# Altium project PCB_Bachelor.PrjPcb
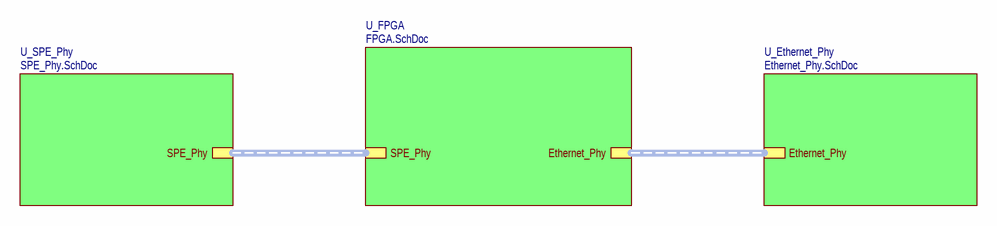
[diagram p0: TopLevel.SchDoc]
Вид_документа_SCH: Схема электрическая принципиальная; Код_документа_SCH: Э3; Обозначение_PCB: SPE_Ethernet; Обозначение_Код: SPE_Ethernet; Формат_PCB: А2
4 sheets, 154 parts. Net scope: hierarchical (ports join the sheet entries above them; power ports are global).
Board file: SPE_To_Ethernet.PcbDoc
Sheets:
  TopLevel.SchDoc
    U_FPGA = FPGA.SchDoc
    U_SPE_Phy = SPE_Phy.SchDoc
    U_Ethernet_Phy = Ethernet_Phy.SchDoc

## Sheet TopLevel.SchDoc
size 420 x 297 mm; SheetNumber: 1; SheetTotal: 4

### Sub-sheets
U_Ethernet_Phy = Ethernet_Phy.SchDoc: Ethernet_Phy (harness Ethernet)
U_FPGA = FPGA.SchDoc: Ethernet_Phy (harness Ethernet), SPE_Phy (harness SPE)
U_SPE_Phy = SPE_Phy.SchDoc: SPE_Phy (harness SPE)

### Buses and harness runs
harness sheet U_Ethernet_Phy/Ethernet_Phy = sheet U_FPGA/Ethernet_Phy
harness sheet U_FPGA/SPE_Phy = sheet U_SPE_Phy/SPE_Phy

### Notes on the sheet
- Подп. дата
- Инв. № дубл.
- Взам. инв. №
- Подп. и дата
- Инв. № подл.
- Изм.
- Лист
- № докум.
- Подп.
- Дата
- ALTIUM GOSTBOM2.0 KEV
- Файл:
- Копировал
- Формат А3

## Sheet FPGA.SchDoc
size 840 x 594 mm; SheetNumber: 2; SheetTotal: 4
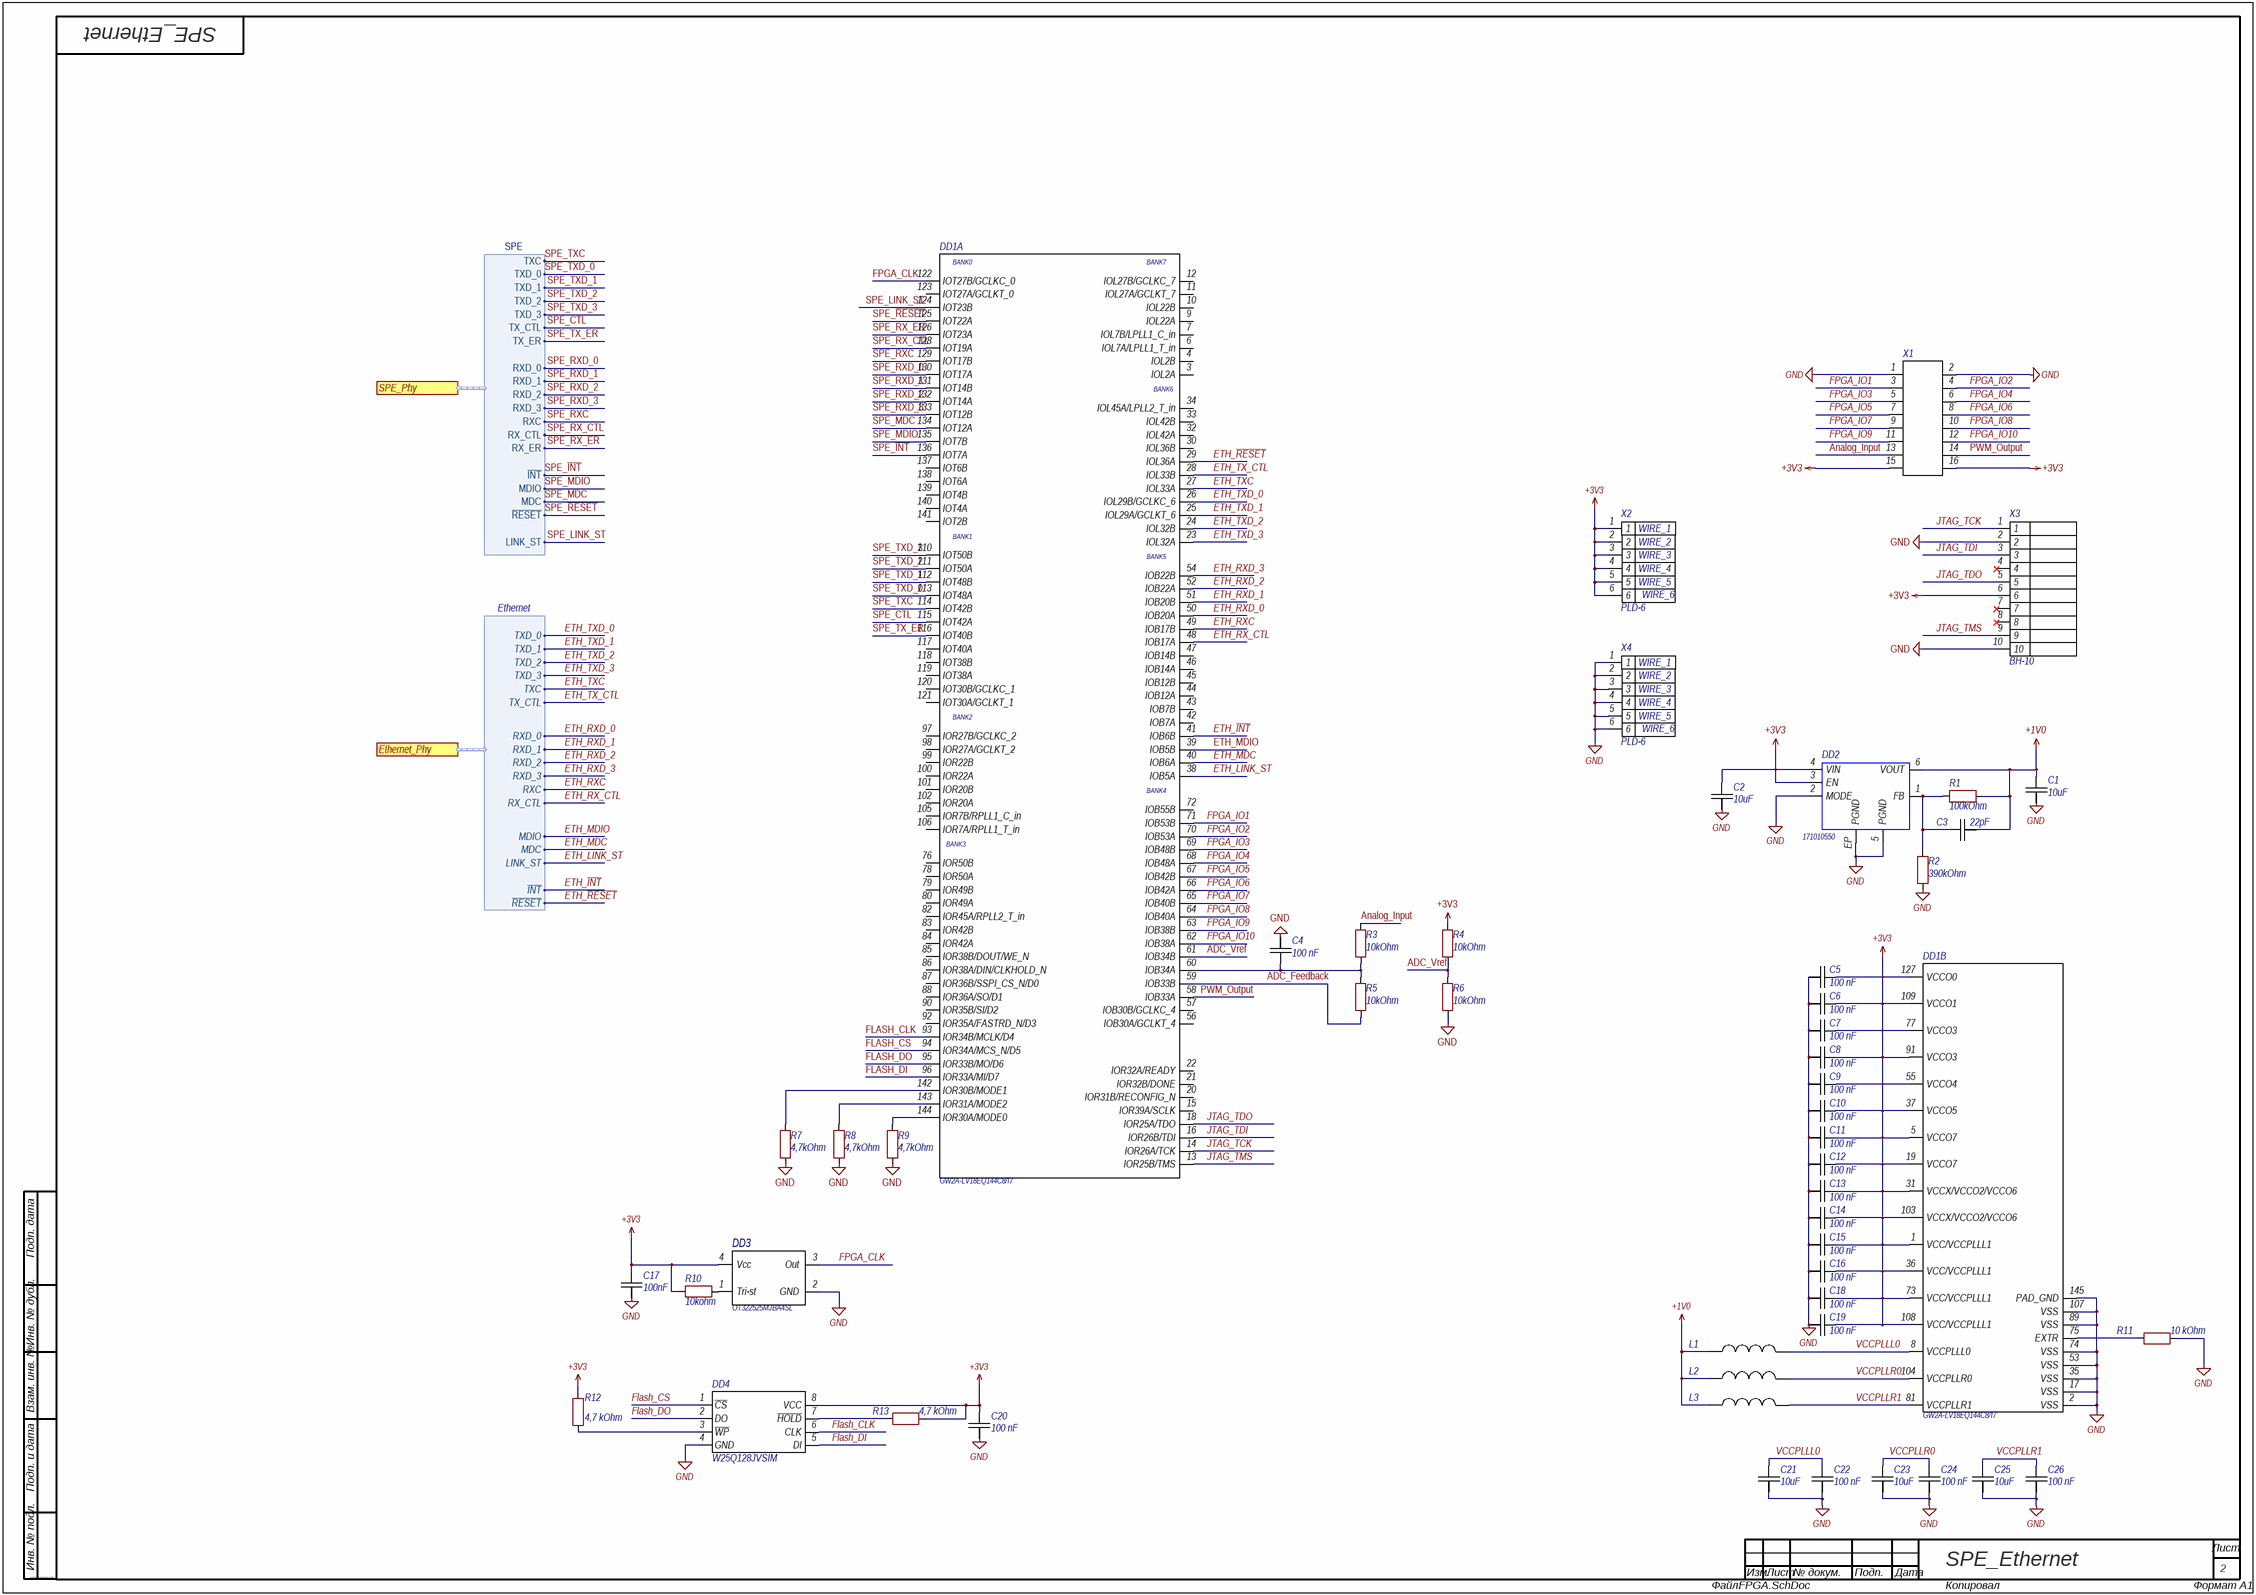
[diagram p1: FPGA.SchDoc]

### Parts
C1  value 10uF  [CAPC0603N]  (hidden comment: 10uF 25V)
C2  value 10uF  [CAPC0603N]  (hidden comment: 10uF 25V)
C3  value 22pF  [CAP0402]  (hidden comment: 22pF 50V)
C4  value 100 nF  [CAP0402]  (hidden comment: 100 nF *)
C5  value 100 nF  [CAP0402]  (hidden comment: 100 nF 50V)
C6  value 100 nF  [CAP0402]  (hidden comment: 100 nF 50V)
C7  value 100 nF  [CAP0402]  (hidden comment: 100 nF 50V)
C8  value 100 nF  [CAP0402]  (hidden comment: 100 nF 50V)
C9  value 100 nF  [CAP0402]  (hidden comment: 100 nF 50V)
C10  value 100 nF  [CAP0402]  (hidden comment: 100 nF 50V)
C11  value 100 nF  [CAP0402]  (hidden comment: 100 nF 50V)
C12  value 100 nF  [CAP0402]  (hidden comment: 100 nF 50V)
C13  value 100 nF  [CAP0402]  (hidden comment: 100 nF 50V)
C14  value 100 nF  [CAP0402]  (hidden comment: 100 nF 50V)
C15  value 100 nF  [CAP0402]  (hidden comment: 100 nF 50V)
C16  value 100 nF  [CAP0402]  (hidden comment: 100 nF 50V)
C17  value 100nF  [CAP0402]  (hidden comment: 100nF 50V)
C18  value 100 nF  [CAP0402]  (hidden comment: 100 nF 50V)
C19  value 100 nF  [CAP0402]  (hidden comment: 100 nF 50V)
C20  value 100 nF  [CAP0402]  (hidden comment: 100 nF 50V)
C21  value 10uF  [CAPC0603N]  (hidden comment: 10uF 25V)
C22  value 100 nF  [CAP0402]  (hidden comment: 100 nF 50V)
C23  value 10uF  [CAPC0603N]  (hidden comment: 10uF 25V)
C24  value 100 nF  [CAP0402]  (hidden comment: 100 nF 50V)
C25  value 10uF  [CAPC0603N]  (hidden comment: 10uF 25V)
C26  value 100 nF  [CAP0402]  (hidden comment: 100 nF 50V)
DD1  MPN: GW2A-LV18EQ144C8/I7  [EQ144]  (parts A,B of 2)
DD2  (no value)  [171010550]
DD3  MPN: OT322525MJBA4SL  [TSX-3225_V]  (hidden comment: 25MHz)
DD4  MPN: W25Q128JVSIM  [SO-8]
L1  (no value)  [CAPC0603N]
L2  (no value)  [CAPC0603N]
L3  (no value)  [CAPC0603N]
R1  100kOhm  [RESC0402(1005)_M]
R2  390kOhm  [RESC0402(1005)_M]
R3  10kOhm  [RESC0402(1005)_M]
R4  10kOhm  [RESC0402(1005)_M]
R5  10kOhm  [RESC0402(1005)_M]
R6  10kOhm  [RESC0402(1005)_M]
R7  4,7kOhm  [RESC0402(1005)_M]
R8  4,7kOhm  [RESC0402(1005)_M]
R9  4,7kOhm  [RESC0402(1005)_M]
R10  10kohm  [RESC0402(1005)_M]
R11  10 kOhm  [RESC0402(1005)_M]
R12  4,7 kOhm  [RESC0402(1005)_M]
R13  4,7 kOhm  [RESC0402(1005)_M]
X1  (no value)  [PBD16]
X2  Wire6: WIRE_6  Wire5: WIRE_5  Wire4: WIRE_4  Wire3: WIRE_3  Wire2: WIRE_2  Wire1: WIRE_1  [PLD_6]  (hidden comment: PLD-6)
X3  BH-10  [BH-10]
X4  Wire6: WIRE_6  Wire5: WIRE_5  Wire4: WIRE_4  Wire3: WIRE_3  Wire2: WIRE_2  Wire1: WIRE_1  [PLD_6]  (hidden comment: PLD-6)

### Ports
Ethernet_Phy (harness Ethernet), SPE_Phy (harness SPE)

### Harnesses
Ethernet: ~{INT}, LINK_ST, MDC, MDIO, ~{RESET}, RX_CTL, RXC, RXD_0, RXD_1, RXD_2, RXD_3, TX_CTL, TXC, TXD_0, TXD_1, TXD_2, TXD_3
SPE: TXC, TXD_0, TXD_1, TXD_2, TXD_3, TX_CTL, TX_ER, RXD_0, RXD_1, RXD_2, RXD_3, RXC, RX_CTL, RX_ER, ~{INT}, MDIO, MDC, ~{RESET}, LINK_ST

### Nets
+1V0: C1.2 C3.1 DD2.6(VOUT) L1.1 L2.1 L3.1 R1.1
+3V3: C2.2 C5.2 C6.2 C7.2 C8.2 C9.2 C10.2 C11.2 C12.2 C13.2 C14.2 C15.2 C16.2 C17.2 C18.2 C19.2 C20.2 DD1.1(VCC/VCCPLLL1) DD1.5(VCCO7) DD1.19(VCCO7) DD1.31(VCCX/VCCO2/VCCO6) DD1.36(VCC/VCCPLLL1) DD1.37(VCCO5) DD1.55(VCCO4) DD1.73(VCC/VCCPLLL1) DD1.77(VCCO3) DD1.91(VCCO3) DD1.103(VCCX/VCCO2/VCCO6) DD1.108(VCC/VCCPLLL1) DD1.109(VCCO1) DD1.127(VCCO0) DD2.3(EN) DD2.4(VIN) DD3.4(Vcc) DD4.8(VCC) R4.2 R10.1 R12.1 R13.2 X1.15 X1.16 X2.1 X2.2 X2.3 X2.4 X2.5 X2.6 X3.6
GND: C1.1 C2.1 C4.1 C5.1 C6.1 C7.1 C8.1 C9.1 C10.1 C11.1 C12.1 C13.1 C14.1 C15.1 C16.1 C17.1 C18.1 C19.1 C20.1 C21.1 C22.1 C23.1 C24.1 C25.1 C26.1 DD1.2(VSS) DD1.17(VSS) DD1.35(VSS) DD1.53(VSS) DD1.74(VSS) DD1.89(VSS) DD1.107(VSS) DD1.145(PAD_GND) DD2.2(MODE) DD2.5(PGND) DD2.EP(PGND) DD3.2(GND) DD4.4(GND) R2.1 R6.1 R7.1 R8.1 R9.1 R11.2 X1.1 X1.2 X3.2 X3.10 X4.1 X4.2 X4.3 X4.4 X4.5 X4.6
ADC_Feedback: DD1.59(IOB33B) R5.1  [project net ADC_Feedback_2]
ADC_Vref: DD1.61(IOB34B) R4.1 R6.2  [project net ADC_Vref_2]
Analog_Input: R3.2 X1.13  [project net Analog_Input_2]
ETH_~{INT}: DD1.41(IOB6B) ; port Ethernet_Phy.~{INT}
ETH_LINK_ST: DD1.38(IOB5A) ; port Ethernet_Phy.LINK_ST
ETH_MDC: DD1.40(IOB6A) ; port Ethernet_Phy.MDC
ETH_MDIO: DD1.39(IOB5B) ; port Ethernet_Phy.MDIO
ETH_~{RESET}: DD1.29(IOL36A) ; port Ethernet_Phy.~{RESET}
ETH_RX_CTL: DD1.48(IOB17A) ; port Ethernet_Phy.RX_CTL
ETH_RXC: DD1.49(IOB17B) ; port Ethernet_Phy.RXC
ETH_RXD_0: DD1.50(IOB20A) ; port Ethernet_Phy.RXD_0
ETH_RXD_1: DD1.51(IOB20B) ; port Ethernet_Phy.RXD_1
ETH_RXD_2: DD1.52(IOB22A) ; port Ethernet_Phy.RXD_2
ETH_RXD_3: DD1.54(IOB22B) ; port Ethernet_Phy.RXD_3
ETH_TX_CTL: DD1.28(IOL33B) ; port Ethernet_Phy.TX_CTL
ETH_TXC: DD1.27(IOL33A) ; port Ethernet_Phy.TXC
ETH_TXD_0: DD1.26(IOL29B/GCLKC_6) ; port Ethernet_Phy.TXD_0
ETH_TXD_1: DD1.25(IOL29A/GCLKT_6) ; port Ethernet_Phy.TXD_1
ETH_TXD_2: DD1.24(IOL32B) ; port Ethernet_Phy.TXD_2
ETH_TXD_3: DD1.23(IOL32A) ; port Ethernet_Phy.TXD_3
Flash_CLK: DD1.93(IOR34B/MCLK/D4) DD4.6(CLK)  [project net Flash_CLK_2]
Flash_CS: DD1.94(IOR34A/MCS_N/D5) DD4.1(~{CS})  [project net Flash_CS_2]
Flash_DI: DD1.96(IOR33A/MI/D7) DD4.5(DI)  [project net Flash_DI_2]
Flash_DO: DD1.95(IOR33B/MO/D6) DD4.2(DO)  [project net Flash_DO_2]
FPGA_CLK: DD1.122(IOT27B/GCLKC_0) DD3.3(Out)  [project net FPGA_CLK_2]
FPGA_IO1: DD1.71(IOB53B) X1.3  [project net FPGA_IO1_2]
FPGA_IO2: DD1.70(IOB53A) X1.4  [project net FPGA_IO2_2]
FPGA_IO3: DD1.69(IOB48B) X1.5  [project net FPGA_IO3_2]
FPGA_IO4: DD1.68(IOB48A) X1.6  [project net FPGA_IO4_2]
FPGA_IO5: DD1.67(IOB42B) X1.7  [project net FPGA_IO5_2]
FPGA_IO6: DD1.66(IOB42A) X1.8  [project net FPGA_IO6_2]
FPGA_IO7: DD1.65(IOB40B) X1.9  [project net FPGA_IO7_2]
FPGA_IO8: DD1.64(IOB40A) X1.10  [project net FPGA_IO8_2]
FPGA_IO9: DD1.63(IOB38B) X1.11  [project net FPGA_IO9_2]
FPGA_IO10: DD1.62(IOB38A) X1.12  [project net FPGA_IO10_2]
JTAG_TCK: DD1.14(IOR26A/TCK) X3.1  [project net JTAG_TCK_2]
JTAG_TDI: DD1.16(IOR26B/TDI) X3.3  [project net JTAG_TDI_2]
JTAG_TDO: DD1.18(IOR25A/TDO) X3.5  [project net JTAG_TDO_2]
JTAG_TMS: DD1.13(IOR25B/TMS) X3.9  [project net JTAG_TMS_2]
PWM_Output: DD1.58(IOB33A) X1.14  [project net PWM_Output_2]
SPE_CTL: DD1.115(IOT42A) ; port SPE_Phy.TX_CTL
SPE_~{INT}: DD1.136(IOT7A) ; port SPE_Phy.~{INT}
SPE_LINK_ST: DD1.124(IOT23B) ; port SPE_Phy.LINK_ST
SPE_MDC: DD1.134(IOT12A) ; port SPE_Phy.MDC
SPE_MDIO: DD1.135(IOT7B) ; port SPE_Phy.MDIO
SPE_~{RESET}: DD1.125(IOT22A) ; port SPE_Phy.~{RESET}
SPE_RX_CTL: DD1.128(IOT19A) ; port SPE_Phy.RX_CTL
SPE_RX_ER: DD1.126(IOT23A) ; port SPE_Phy.RX_ER
SPE_RXC: DD1.129(IOT17B) ; port SPE_Phy.RXC
SPE_RXD_0: DD1.130(IOT17A) ; port SPE_Phy.RXD_0
SPE_RXD_1: DD1.131(IOT14B) ; port SPE_Phy.RXD_1
SPE_RXD_2: DD1.132(IOT14A) ; port SPE_Phy.RXD_2
SPE_RXD_3: DD1.133(IOT12B) ; port SPE_Phy.RXD_3
SPE_TX_ER: DD1.116(IOT40B) ; port SPE_Phy.TX_ER
SPE_TXC: DD1.114(IOT42B) ; port SPE_Phy.TXC
SPE_TXD_0: DD1.113(IOT48A) ; port SPE_Phy.TXD_0
SPE_TXD_1: DD1.112(IOT48B) ; port SPE_Phy.TXD_1
SPE_TXD_2: DD1.111(IOT50A) ; port SPE_Phy.TXD_2
SPE_TXD_3: DD1.110(IOT50B) ; port SPE_Phy.TXD_3
VCCPLLL0: C21.2 C22.2 DD1.8(VCCPLLL0) L1.2  [project net VCCPLLL0_2]
VCCPLLR0: C23.2 C24.2 DD1.104(VCCPLLR0) L2.2  [project net VCCPLLR0_2]
VCCPLLR1: C25.2 C26.2 DD1.81(VCCPLLR1) L3.2  [project net VCCPLLR1_2]
NetC3_2: C3.2 DD2.1(FB) R1.2 R2.2
NetC4_2: C4.2 DD1.60(IOB34A) R3.1 R5.2
NetDD1_75: DD1.75(EXTR) R11.1
NetDD1_142: DD1.142(IOR30B/MODE1) R7.2
NetDD1_143: DD1.143(IOR31A/MODE2) R8.2
NetDD1_144: DD1.144(IOR30A/MODE0) R9.2
NetDD3_1: DD3.1(Tri-st) R10.2
NetDD4_3: DD4.3(~{WP}) R12.2
NetDD4_7: DD4.7(~{HOLD}) R13.1

Not connected (* = marked no-connect by the designer): DD1 3(IOL2A) 4(IOL2B) 6(IOL7A/LPLL1_T_in) 7(IOL7B/LPLL1_C_in) 9(IOL22A) 10(IOL22B) 11(IOL27A/GCLKT_7) 12(IOL27B/GCLKC_7) 15(IOR39A/SCLK) 20(IOR31B/RECONFIG_N) 21(IOR32B/DONE) 22(IOR32A/READY) 30(IOL36B) 32(IOL42A) 33(IOL42B) 34(IOL45A/LPLL2_T_in) 42(IOB7A) 43(IOB7B) 44(IOB12A) 45(IOB12B) 46(IOB14A) 47(IOB14B) 56(IOB30A/GCLKT_4) 57(IOB30B/GCLKC_4) 72(IOB55B) 76(IOR50B) 78(IOR50A) 79(IOR49B) 80(IOR49A) 82(IOR45A/RPLL2_T_in) 83(IOR42B) 84(IOR42A) 85(IOR38B/DOUT/WE_N) 86(IOR38A/DIN/CLKHOLD_N) 87(IOR36B/SSPI_CS_N/D0) 88(IOR36A/SO/D1) 90(IOR35B/SI/D2) 92(IOR35A/FASTRD_N/D3) 97(IOR27B/GCLKC_2) 98(IOR27A/GCLKT_2) 99(IOR22B) 100(IOR22A) 101(IOR20B) 102(IOR20A) 105(IOR7B/RPLL1_C_in) 106(IOR7A/RPLL1_T_in) 117(IOT40A) 118(IOT38B) 119(IOT38A) 120(IOT30B/GCLKC_1) 121(IOT30A/GCLKT_1) 123(IOT27A/GCLKT_0) 137(IOT6B) 138(IOT6A) 139(IOT4B) 140(IOT4A) 141(IOT2B); X3 4* 7* 8*

### Notes on the sheet
- Подп. дата
- Инв. № дубл.
- Взам. инв. №
- Подп. и дата
- Инв. № подл.
- Изм.
- Лист
- № докум.
- Подп.
- Дата
- ALTIUM GOSTBOM2.0 KEV
- Файл:
- Копировал
- Формат А1
- (in symbol GW2A-LV18EQ144C8/I7, part A) BANK0; BANK7; BANK6; BANK1; BANK5; BANK2; BANK4; BANK3

### Library data of the parts
C1 C2 C21 C23 C25 = CAPC: MntType: SMD; MSL: MSL 1; Package: =Footprint; RoHS: Comply; PartType: CHIP CERAMIC CAPACITOR; Pins: 2; BOMDescription: =MntType+' '+PartType+' '+Package+' '+Value+' '+Tolerance+' '+Voltage+' '+TempCoeff+' '+MPN; CFootprint: =Footprint; Voltage: 25V; Part Number: CAPC; ClassName: Capacitor; ComponentLink1Description: Datasheet
C3 C5-C20 C22 C24 C26 = CAP0402: MntType: SMD; MSL: MSL 1; Package: =Footprint; RoHS: Comply; PartType: CHIP CERAMIC CAPACITOR; Pins: 2; BOMDescription: =MntType+' '+PartType+' '+Package+' '+Value+' '+Tolerance+' '+Voltage+' '+TempCoeff+' '+MPN; CFootprint: =Footprint; Voltage: 50V; Part Number: CAP0402; ClassName: Capacitor; ComponentLink1Description: Datasheet
C4 = CAP0402: PartTypeRUS: пїЅпїЅпїЅпїЅпїЅпїЅпїЅпїЅпїЅпїЅпїЅ; MntType: SMD; ID: 82; MSL: MSL 1; Package: =Footprint; RoHS: Comply; PartType: CHIP CERAMIC CAPACITOR; Pins: 2; BOMDescription: =MntType+' '+PartType+' '+Package+' '+Value+' '+Tolerance+' '+Voltage+' '+TempCoeff+' '+MPN; CFootprint: =Footprint; Voltage: *; Part Number: CAP0402; BOMDescriptionRUS: пїЅпїЅпїЅпїЅпїЅпїЅпїЅпїЅпїЅпїЅпїЅ; ClassName: Capacitor; ComponentLink1Description: Datasheet
DD1 = GW2A-LV18EQ144C8/I7: Manufacturer: GoWin; PartTypeRUS: пїЅпїЅпїЅпїЅпїЅпїЅпїЅпїЅпїЅпїЅ; ID: 149; MntType: SMD; BOMDescriptionRUS: пїЅпїЅпїЅпїЅпїЅпїЅпїЅпїЅпїЅпїЅ GW2A-LV18EQ144C8/I7; Part Number: GW2A-LV18EQ144C8/I7; MSL: MSL 1; Package: EQ144; RoHS: Comply; PartType: FPGA; BOMDescription: GW2A-LV18EQ144C8/I7; Pins: 144; CFootprint: =Footprint; ClassName: FPGA; ComponentLink1Description: Datasheet; ComponentLink1URL: https://gowinsemi.com/en/support/database/?support_search=DS102
DD2 = 171010550: Manufacturer: WE; MntType: SMD; MPN: 171010550; Part Number: 171010550; MSL: MSL 1; Package: LGA-6EP; RoHS: Comply; PartType: Buck converter; Pins: 8; BOMDescription: 171010550; CFootprint: =Footprint; ClassName: Buck; ComponentLink1Description: Datasheet; ComponentLink1URL: https://www.we-online.com/catalog/datasheet/171010550_valid_from_2021-12-01.pdf
DD3 = OT322525MJBA4SL: Manufacturer: Yangxing Tech; MntType: SMD; Part Number: OT322525MJBA4SL; Value: 25MHz; MSL: MSL 1; Package: SMD3225; RoHS: Comply; PartType: Oscillator; Pins: 4; BOMDescription: OT322525MJBA4SL; CFootprint: =Footprint; ClassName: Oscillator; ComponentLink1Description: Datasheet; ComponentLink1URL: https://datasheet.lcsc.com/lcsc/2103291238_Yangxing-Tech-OT322525MJBA4SL_C669088.pdf
DD4 = W25Q128JVSIM: Manufacturer: WINBOND; MntType: SMD; Part Number: W25Q128JVSIM; MSL: MSL 1; Package: SO-8; RoHS: Comply; PartType: Flash; Pins: 8; BOMDescription: W25Q128JVSIM; CFootprint: =Footprint; ClassName: Flash; ComponentLink1Description: Datasheet; ComponentLink1URL: https://www.winbond.com/resource-files/w25q128jv_dtr%20revc%2003272018%20plus.pdf
L1-L3 = BLM18KG221SN1D: Manufacturer: Murata; MntType: SMD; MPN: BLM18KG221SN1D; MSL: MSL 1; Package: =Footprint; RoHS: Comply; PartType: Ferrite Beads; Pins: 2; BOMDescription: =MntType+' '+PartType+' '+Package+' '+Value+' '+Tolerance+' '+Voltage+' '+TempCoeff+' '+MPN; CFootprint: =Footprint; Part Number: BLM18KG221SN1D; ClassName: Ferrite Beads; ComponentLink1Description: Datasheet; ComponentLink1URL: https://ru.mouser.com/datasheet/2/281/ENFA0003-1915778.pdf
R1 R2 R10-R13 = RES0402: MntType: SMD; MSL: MSL 1; Package: =Footprint; RoHS: Comply; PartType: CHIP RESISTOR; Pins: 2; BOMDescription: =MntType+' '+PartType+' '+Package+' '+Value+' '+Tolerance+' '+Voltage+' '+TempCoeff+' '+MPN; CFootprint: =Footprint; Part Number: RES0402; ClassName: Resistor; ComponentLink1Description: Datasheet
  R1: Value: 100kOhm
  R2: Value: 390kOhm
  R10: Value: 10kohm
  R11: Value: 10 kOhm
  R12 R13: Value: 4,7 kOhm
R3-R9 = RES0402: PartTypeRUS: пїЅпїЅпїЅпїЅпїЅпїЅпїЅпїЅ; MntType: SMD; ID: 301; MSL: MSL 1; Package: =Footprint; RoHS: Comply; PartType: CHIP RESISTOR; Pins: 2; BOMDescription: =MntType+' '+PartType+' '+Package+' '+Value+' '+Tolerance+' '+Voltage+' '+TempCoeff+' '+MPN; CFootprint: =Footprint; Part Number: RES0402; BOMDescriptionRUS: пїЅпїЅпїЅпїЅпїЅпїЅпїЅпїЅ; ClassName: Resistor; ComponentLink1Description: Datasheet
  R3-R6: Value: 10kOhm
  R7-R9: Value: 4,7kOhm
X1 = Connector_16pin: PartTypeRUS: пїЅпїЅпїЅпїЅпїЅпїЅ; ID: 101; MntType: DIP; Part Number: Connector_16pin; MSL: MSL 1; RoHS: Comply; PartType: CONNECTOR; BOMDescription: =MntType+' '+PartType+' '+Package+' '+Value+' '+Tolerance+' '+Voltage+' '+TempCoeff+' '+MPN; Pins: 16; BOMDescriptionRUS: =PartTypeRUS+' '+MPN; CFootprint: =Footprint; ClassName: Connector; System: Connector; ComponentLink1Description: Datasheet
X2 X4 = PLD-6: Wire8: WIRE_8; Wire7: WIRE_7; MntType: DIP; System: Connector; MPN: PLD-6; Part Number: PLD-6; MSL: MSL 1; RoHS: Comply; PartType: CONNECTOR; Pins: 6; BOMDescription: PLD-6; CFootprint: =Footprint; ClassName: Connector; ComponentLink1Description: Datasheet
X3 = BH-10: PartTypeRUS: пїЅпїЅпїЅпїЅпїЅпїЅ; ID: 68; MntType: DIP; BOMDescriptionRUS: пїЅпїЅпїЅпїЅпїЅпїЅ BH-10; System: Connector; MPN: BH-10; Part Number: BH-10; MSL: MSL 1; Package: BH-10; RoHS: Comply; PartType: CONNECTOR; BOMDescription: =MntType+' '+PartType+' '+Package+' '+Value+' '+Tolerance+' '+Voltage+' '+TempCoeff+' '+MPN; Pins: 10; CFootprint: =Footprint; ClassName: Connector; ComponentLink1Description: Datasheet

## Sheet SPE_Phy.SchDoc
size 594 x 420 mm; SheetNumber: 4; SheetTotal: 4
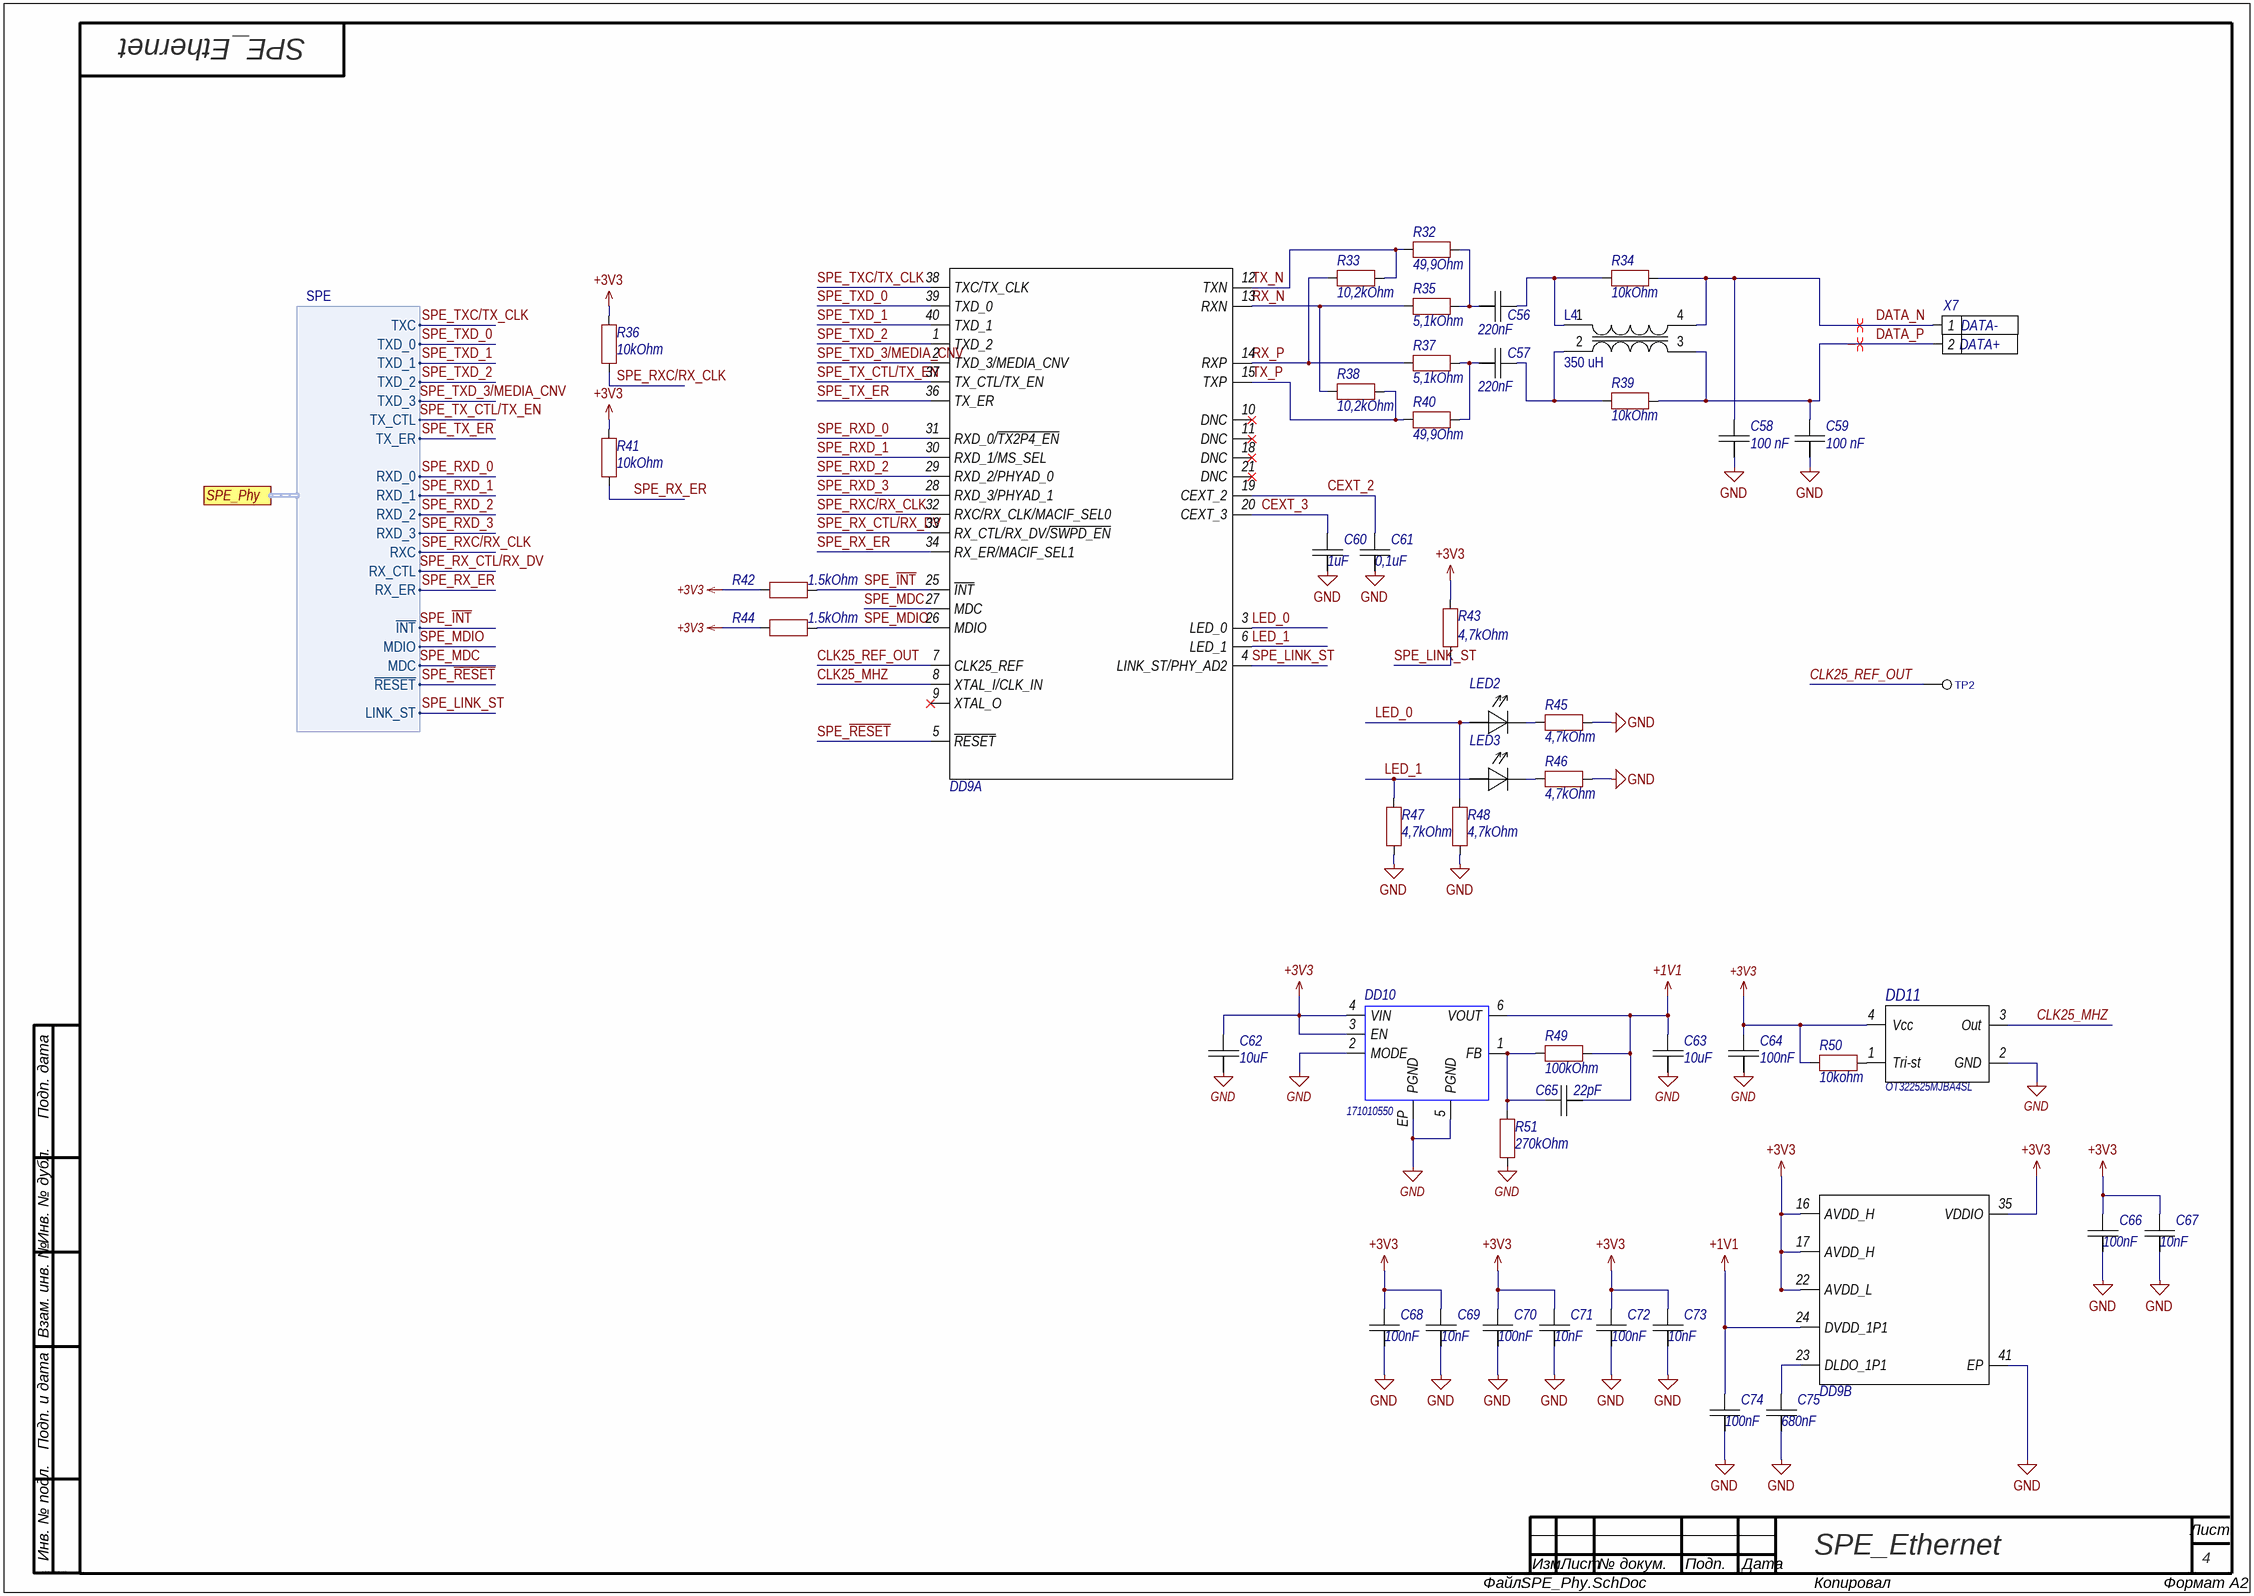
[diagram p2: SPE_Phy.SchDoc]

### Parts
C56  value 220nF  [CAP0402]  (hidden comment: 220nF *)
C57  value 220nF  [CAP0402]  (hidden comment: 220nF *)
C58  value 100 nF  [CAPC0805N]  (hidden comment: 100 nF 1kV)
C59  value 100 nF  [CAPC0805N]  (hidden comment: 100 nF 1kV)
C60  value 1uF  [CAP0402]  (hidden comment: 1uF *)
C61  value 0,1uF  [CAP0402]  (hidden comment: 0,1uF *)
C62  value 10uF  [CAPC0603N]  (hidden comment: 10uF 25V)
C63  value 10uF  [CAPC0603N]  (hidden comment: 10uF *)
C64  value 100nF  [CAP0402]  (hidden comment: 100nF *)
C65  value 22pF  [CAP0402]  (hidden comment: 22pF 50V)
C66  value 100nF  [CAP0402]  (hidden comment: 100nF *)
C67  value 10nF  [CAP0402]  (hidden comment: 10nF *)
C68  value 100nF  [CAP0402]  (hidden comment: 100nF *)
C69  value 10nF  [CAP0402]  (hidden comment: 10nF *)
C70  value 100nF  [CAP0402]  (hidden comment: 100nF *)
C71  value 10nF  [CAP0402]  (hidden comment: 10nF *)
C72  value 100nF  [CAP0402]  (hidden comment: 100nF *)
C73  value 10nF  [CAP0402]  (hidden comment: 10nF *)
C74  value 100nF  [CAP0402]  (hidden comment: 100nF *)
C75  value 680nF  [CAP0402]  (hidden comment: 680nF *)
DD9  (no value)  [LFCSP-40-01]  (parts A,B of 2)
DD10  (no value)  [171010550]
DD11  MPN: OT322525MJBA4SL  [TSX-3225_V]  (hidden comment: 25MHz)
L4  350 uH  [CHOKE_242471_WRE]
LED2  Green  [LED0805]  (value not drawn)
LED3  Green  [LED0805]  (value not drawn)
R32  49,9Ohm  [RESC0402(1005)_M]
R33  10,2kOhm  [RESC0402(1005)_M]
R34  10kOhm  [RESC0402(1005)_M]
R35  5,1kOhm  [RESC0402(1005)_M]
R36  10kOhm  [RESC0402(1005)_M]
R37  5,1kOhm  [RESC0402(1005)_M]
R38  10,2kOhm  [RESC0402(1005)_M]
R39  10kOhm  [RESC0402(1005)_M]
R40  49,9Ohm  [RESC0402(1005)_M]
R41  10kOhm  [RESC0402(1005)_M]
R42  1.5kOhm  [RESC0402(1005)_M]
R43  4,7kOhm  [RESC0805L]
R44  1.5kOhm  [RESC0402(1005)_M]
R45  4,7kOhm  [RESC0402(1005)_M]
R46  4,7kOhm  [RESC0402(1005)_M]
R47  4,7kOhm  [RESC0402(1005)_M]
R48  4,7kOhm  [RESC0402(1005)_M]
R49  100kOhm  [RESC0402(1005)_M]
R50  10kohm  [RESC0402(1005)_M]
R51  270kOhm  [RESC0402(1005)_M]
TP2  TP-SINGLE-ROUND  [TP-ROUND-TOP-1.5]  (value not drawn)  (no BOM)
X7  Wire2: DATA+  Wire1: DATA-  [X_XH-2A_2.5]  (hidden comment: XH-2A)

### Ports
SPE_Phy (harness SPE)

### Harnesses
SPE: TXC, TXD_0, TXD_1, TXD_2, TXD_3, TX_CTL, TX_ER, RXD_0, RXD_1, RXD_2, RXD_3, RXC, RX_CTL, RX_ER, ~{INT}, MDIO, MDC, ~{RESET}, LINK_ST

### Nets
+1V1: C63.2 C65.1 C74.2 DD9.24(DVDD_1P1) DD10.6(VOUT) R49.1
+3V3: C62.2 C64.2 C66.2 C67.2 C68.2 C69.2 C70.2 C71.2 C72.2 C73.2 DD9.16(AVDD_H) DD9.17(AVDD_H) DD9.22(AVDD_L) DD9.35(VDDIO) DD10.3(EN) DD10.4(VIN) DD11.4(Vcc) R36.2 R41.2 R42.1 R43.2 R44.1 R50.1
GND: C58.1 C59.1 C60.1 C61.1 C62.1 C63.1 C64.1 C66.1 C67.1 C68.1 C69.1 C70.1 C71.1 C72.1 C73.1 C74.1 C75.1 DD9.41(EP) DD10.2(MODE) DD10.5(PGND) DD10.EP(PGND) DD11.2(GND) R45.1 R46.1 R47.2 R48.2 R51.1
CEXT_2: C61.2 DD9.19(CEXT_2)  [project net CEXT_2_4]
CEXT_3: C60.2 DD9.20(CEXT_3)  [project net CEXT_3_4]
CLK25_MHZ: DD9.8(XTAL_I/CLK_IN) DD11.3(Out)  [project net CLK25_MHZ_4]
CLK25_REF_OUT: DD9.7(CLK25_REF) TP2.1  [project net CLK25_REF_OUT_4]
DATA_N: C58.2 L4.4 R34.1 X7.1  [project net DATA_N_4]
DATA_P: C59.2 L4.3 R39.1 X7.2  [project net DATA_P_4]
LED_0: DD9.3(LED_0) LED2.2(K) R48.1  [project net LED_0_4]
LED_1: DD9.6(LED_1) LED3.2(K) R47.1  [project net LED_1_4]
RX_N: DD9.13(RXN) R35.1 R38.1  [project net RX_N_4]
RX_P: DD9.14(RXP) R33.1 R37.1  [project net RX_P_4]
SPE_~{INT}: DD9.25(~{INT}) R42.2 ; port SPE_Phy.~{INT}
SPE_LINK_ST: DD9.4(LINK_ST/PHY_AD2) R43.1 ; port SPE_Phy.LINK_ST
SPE_MDC: DD9.27(MDC) ; port SPE_Phy.MDC
SPE_MDIO: DD9.26(MDIO) R44.2 ; port SPE_Phy.MDIO
SPE_~{RESET}: DD9.5(~{RESET}) ; port SPE_Phy.~{RESET}
SPE_RX_CTL/RX_DV: DD9.33(RX_CTL/RX_DV/~{SWPD_EN}) ; port SPE_Phy.RX_CTL  [project net SPE_RX_CTL]
SPE_RX_ER: DD9.34(RX_ER/MACIF_SEL1) R41.1 ; port SPE_Phy.RX_ER
SPE_RXC/RX_CLK: DD9.32(RXC/RX_CLK/MACIF_SEL0) R36.1 ; port SPE_Phy.RXC  [project net SPE_RXC]
SPE_RXD_0: DD9.31(RXD_0/~{TX2P4_EN}) ; port SPE_Phy.RXD_0
SPE_RXD_1: DD9.30(RXD_1/MS_SEL) ; port SPE_Phy.RXD_1
SPE_RXD_2: DD9.29(RXD_2/PHYAD_0) ; port SPE_Phy.RXD_2
SPE_RXD_3: DD9.28(RXD_3/PHYAD_1) ; port SPE_Phy.RXD_3
SPE_TX_CTL/TX_EN: DD9.37(TX_CTL/TX_EN) ; port SPE_Phy.TX_CTL  [project net SPE_CTL]
SPE_TX_ER: DD9.36(TX_ER) ; port SPE_Phy.TX_ER
SPE_TXC/TX_CLK: DD9.38(TXC/TX_CLK) ; port SPE_Phy.TXC  [project net SPE_TXC]
SPE_TXD_0: DD9.39(TXD_0) ; port SPE_Phy.TXD_0
SPE_TXD_1: DD9.40(TXD_1) ; port SPE_Phy.TXD_1
SPE_TXD_2: DD9.1(TXD_2) ; port SPE_Phy.TXD_2
SPE_TXD_3/MEDIA_CNV: DD9.2(TXD_3/MEDIA_CNV) ; port SPE_Phy.TXD_3  [project net SPE_TXD_3]
TX_N: DD9.12(TXN) R32.1 R33.2  [project net TX_N_4]
TX_P: DD9.15(TXP) R38.2 R40.1  [project net TX_P_4]
NetC56_1: C56.1 R32.2 R35.2
NetC56_2: C56.2 L4.1 R34.2
NetC57_1: C57.1 R37.2 R40.2
NetC57_2: C57.2 L4.2 R39.2
NetC65_2: C65.2 DD10.1(FB) R49.2 R51.2
NetC75_2: C75.2 DD9.23(DLDO_1P1)
NetDD11_1: DD11.1(Tri-st) R50.2
NetLED2_1: LED2.1(A) R45.2
NetLED3_1: LED3.1(A) R46.2

Not connected (* = marked no-connect by the designer): DD9 9(XTAL_O)* 10(DNC)* 11(DNC)* 18(DNC)* 21(DNC)*

### Layout directives
differential pair: DATA_N_4, DATA_P_4

### Notes on the sheet
- Подп. дата
- Инв. № дубл.
- Взам. инв. №
- Подп. и дата
- Инв. № подл.
- Изм.
- Лист
- № докум.
- Подп.
- Дата
- ALTIUM GOSTBOM2.0 KEV
- Файл:
- Копировал
- Формат А2

### Library data of the parts
C56 C57 C60 C61 C64 C66-C75 = CAP0402: as C4 on sheet FPGA; MSL: MSL 1; Package: =Footprint; RoHS: Comply; PartType: CHIP CERAMIC CAPACITOR; Pins: 2; BOMDescription: =MntType+' '+PartType+' '+Package+' '+Value+' '+Tolerance+' '+Voltage+' '+TempCoeff+' '+MPN; CFootprint: =Footprint; Voltage: *; Part Number: CAP0402; BOMDescriptionRUS: пїЅпїЅпїЅпїЅпїЅпїЅпїЅпїЅпїЅпїЅпїЅ; ClassName: Capacitor; ComponentLink1Description: Datasheet
C58 C59 C62 C63 = CAPC: PartTypeRUS: пїЅпїЅпїЅпїЅпїЅпїЅпїЅпїЅпїЅпїЅпїЅ; MntType: SMD; ID: 83; MSL: MSL 1; Package: =Footprint; RoHS: Comply; PartType: CHIP CERAMIC CAPACITOR; Pins: 2; BOMDescription: =MntType+' '+PartType+' '+Package+' '+Value+' '+Tolerance+' '+Voltage+' '+TempCoeff+' '+MPN; CFootprint: =Footprint; Part Number: CAPC; BOMDescriptionRUS: пїЅпїЅпїЅпїЅпїЅпїЅпїЅпїЅпїЅпїЅпїЅ; ClassName: Capacitor; ComponentLink1Description: Datasheet
  C58 C59: Voltage: 1kV
  C62: Voltage: 25V
  C63: Voltage: *
C65 = CAP0402: MntType: SMD; MSL: MSL 1; Package: =Footprint; RoHS: Comply; PartType: CHIP CERAMIC CAPACITOR; Pins: 2; BOMDescription: =MntType+' '+PartType+' '+Package+' '+Value+' '+Tolerance+' '+Voltage+' '+TempCoeff+' '+MPN; CFootprint: =Footprint; Voltage: 50V; Part Number: CAP0402; ClassName: Capacitor; ComponentLink1Description: Datasheet
DD9 = ADIN1100BCPZ: Manufacturer: AD; PartTypeRUS: пїЅпїЅпїЅпїЅпїЅпїЅпїЅпїЅпїЅпїЅ; ID: 430; MntType: SMD; BOMDescriptionRUS: пїЅпїЅпїЅпїЅпїЅпїЅпїЅпїЅпїЅпїЅ ADIN1100BCPZ; Part Number: ADIN1100BCPZ; MPN: ADIN1100BCPZ; MSL: MSL 1; Package: =Footprint; RoHS: Comply; PartType: SPE Phy; BOMDescription: ADIN1100BCPZ; Pins: 41; CFootprint: =Footprint; ClassName: SPE Phy; ComponentLink1Description: Datasheet; ComponentLink1URL: https://www.analog.com/media/en/technical-documentation/data-sheets/adin1100.pdf
DD10 = 171010550: Manufacturer: WE; MntType: SMD; MPN: 171010550; Part Number: 171010550; MSL: MSL 1; Package: LGA-6EP; RoHS: Comply; PartType: Buck converter; Pins: 8; BOMDescription: 171010550; CFootprint: =Footprint; ClassName: Buck; ComponentLink1Description: Datasheet; ComponentLink1URL: https://www.we-online.com/catalog/datasheet/171010550_valid_from_2021-12-01.pdf
DD11 = OT322525MJBA4SL: as DD3 on sheet FPGA; Part Number: OT322525MJBA4SL; Value: 25MHz; MSL: MSL 1; Package: SMD3225; RoHS: Comply; PartType: Oscillator; Pins: 4; BOMDescription: OT322525MJBA4SL; CFootprint: =Footprint; ClassName: Oscillator; ComponentLink1Description: Datasheet; ComponentLink1URL: https://datasheet.lcsc.com/lcsc/2103291238_Yangxing-Tech-OT322525MJBA4SL_C669088.pdf
L4 = 744242471: SMD Common Mode Choke 350 uH
LED2 LED3 = LEDC0805: PartTypeRUS: пїЅпїЅпїЅпїЅпїЅпїЅпїЅпїЅпїЅ; MntType: SMD; ID: 197; Value: Green; MSL: MSL 5; Package: =Footprint; RoHS: Comply; PartType: CHIP LED; Pins: 2; BOMDescription: =MntType+' '+PartType+' '+Package+' '+Value+' '+Tolerance+' '+Voltage+' '+TempCoeff+' '+MPN; CFootprint: =Footprint; Part Number: LEDC0805; BOMDescriptionRUS: пїЅпїЅпїЅпїЅпїЅпїЅпїЅпїЅпїЅ; ClassName: LED; ComponentLink1Description: Datasheet
R32-R41 R45-R48 = RES0402: as R3 on sheet FPGA; MSL: MSL 1; Package: =Footprint; RoHS: Comply; PartType: CHIP RESISTOR; Pins: 2; BOMDescription: =MntType+' '+PartType+' '+Package+' '+Value+' '+Tolerance+' '+Voltage+' '+TempCoeff+' '+MPN; CFootprint: =Footprint; Part Number: RES0402; BOMDescriptionRUS: пїЅпїЅпїЅпїЅпїЅпїЅпїЅпїЅ; ClassName: Resistor; ComponentLink1Description: Datasheet
  R32 R40: Value: 49,9Ohm
  R33 R38: Value: 10,2kOhm
  R34 R36 R39 R41: Value: 10kOhm
  R35 R37: Value: 5,1kOhm
  R45-R48: Value: 4,7kOhm
R42 R44 R49-R51 = RES0402: MntType: SMD; MSL: MSL 1; Package: =Footprint; RoHS: Comply; PartType: CHIP RESISTOR; Pins: 2; BOMDescription: =MntType+' '+PartType+' '+Package+' '+Value+' '+Tolerance+' '+Voltage+' '+TempCoeff+' '+MPN; CFootprint: =Footprint; Part Number: RES0402; ClassName: Resistor; ComponentLink1Description: Datasheet
  R42 R44: Value: 1.5kOhm
  R49: Value: 100kOhm
  R50: Value: 10kohm
  R51: Value: 270kOhm
R43 = RES: PartTypeRUS: пїЅпїЅпїЅпїЅпїЅпїЅпїЅпїЅ; MntType: SMD; ID: 300; MSL: MSL 1; Package: =Footprint; RoHS: Comply; PartType: CHIP RESISTOR; Pins: 2; BOMDescription: =MntType+' '+PartType+' '+Package+' '+Value+' '+Tolerance+' '+Voltage+' '+TempCoeff+' '+MPN; CFootprint: =Footprint; Value: 4,7kOhm; Part Number: RES; BOMDescriptionRUS: пїЅпїЅпїЅпїЅпїЅпїЅпїЅпїЅ; ClassName: Resistor; ComponentLink1Description: Datasheet
TP2 = TP-SINGLE-ROUND: MntType: SMD; MSL: MSL 1; RoHS: Comply; BOMDescription: SMD; CFootprint: =Footprint; Part Number: TP-SINGLE-ROUND; ClassName: Touch; ComponentLink1Description: Datasheet
X7 = XH-2A: PartTypeRUS: пїЅпїЅпїЅпїЅпїЅпїЅ; ID: 410; MntType: DIP; BOMDescriptionRUS: пїЅпїЅпїЅпїЅпїЅпїЅ XH-2A; System: Connector; MPN: XH-2A; Part Number: XH-2A; Value: XH-2A; MSL: MSL 1; RoHS: Comply; PartType: CONNECTOR; BOMDescription: =MntType+' '+PartType+' '+Package+' '+Value+' '+Tolerance+' '+Voltage+' '+TempCoeff+' '+MPN; Pins: 2; CFootprint: =Footprint; ClassName: Connector; ComponentLink1Description: Datasheet; ComponentLink1URL: https://datasheet.lcsc.com/szlcsc/1811132110_BOOMELE-Boom-Precision-Elec-XH-2A_C20079.pdf

## Sheet Ethernet_Phy.SchDoc
size 594 x 420 mm; SheetNumber: 3; SheetTotal: 4
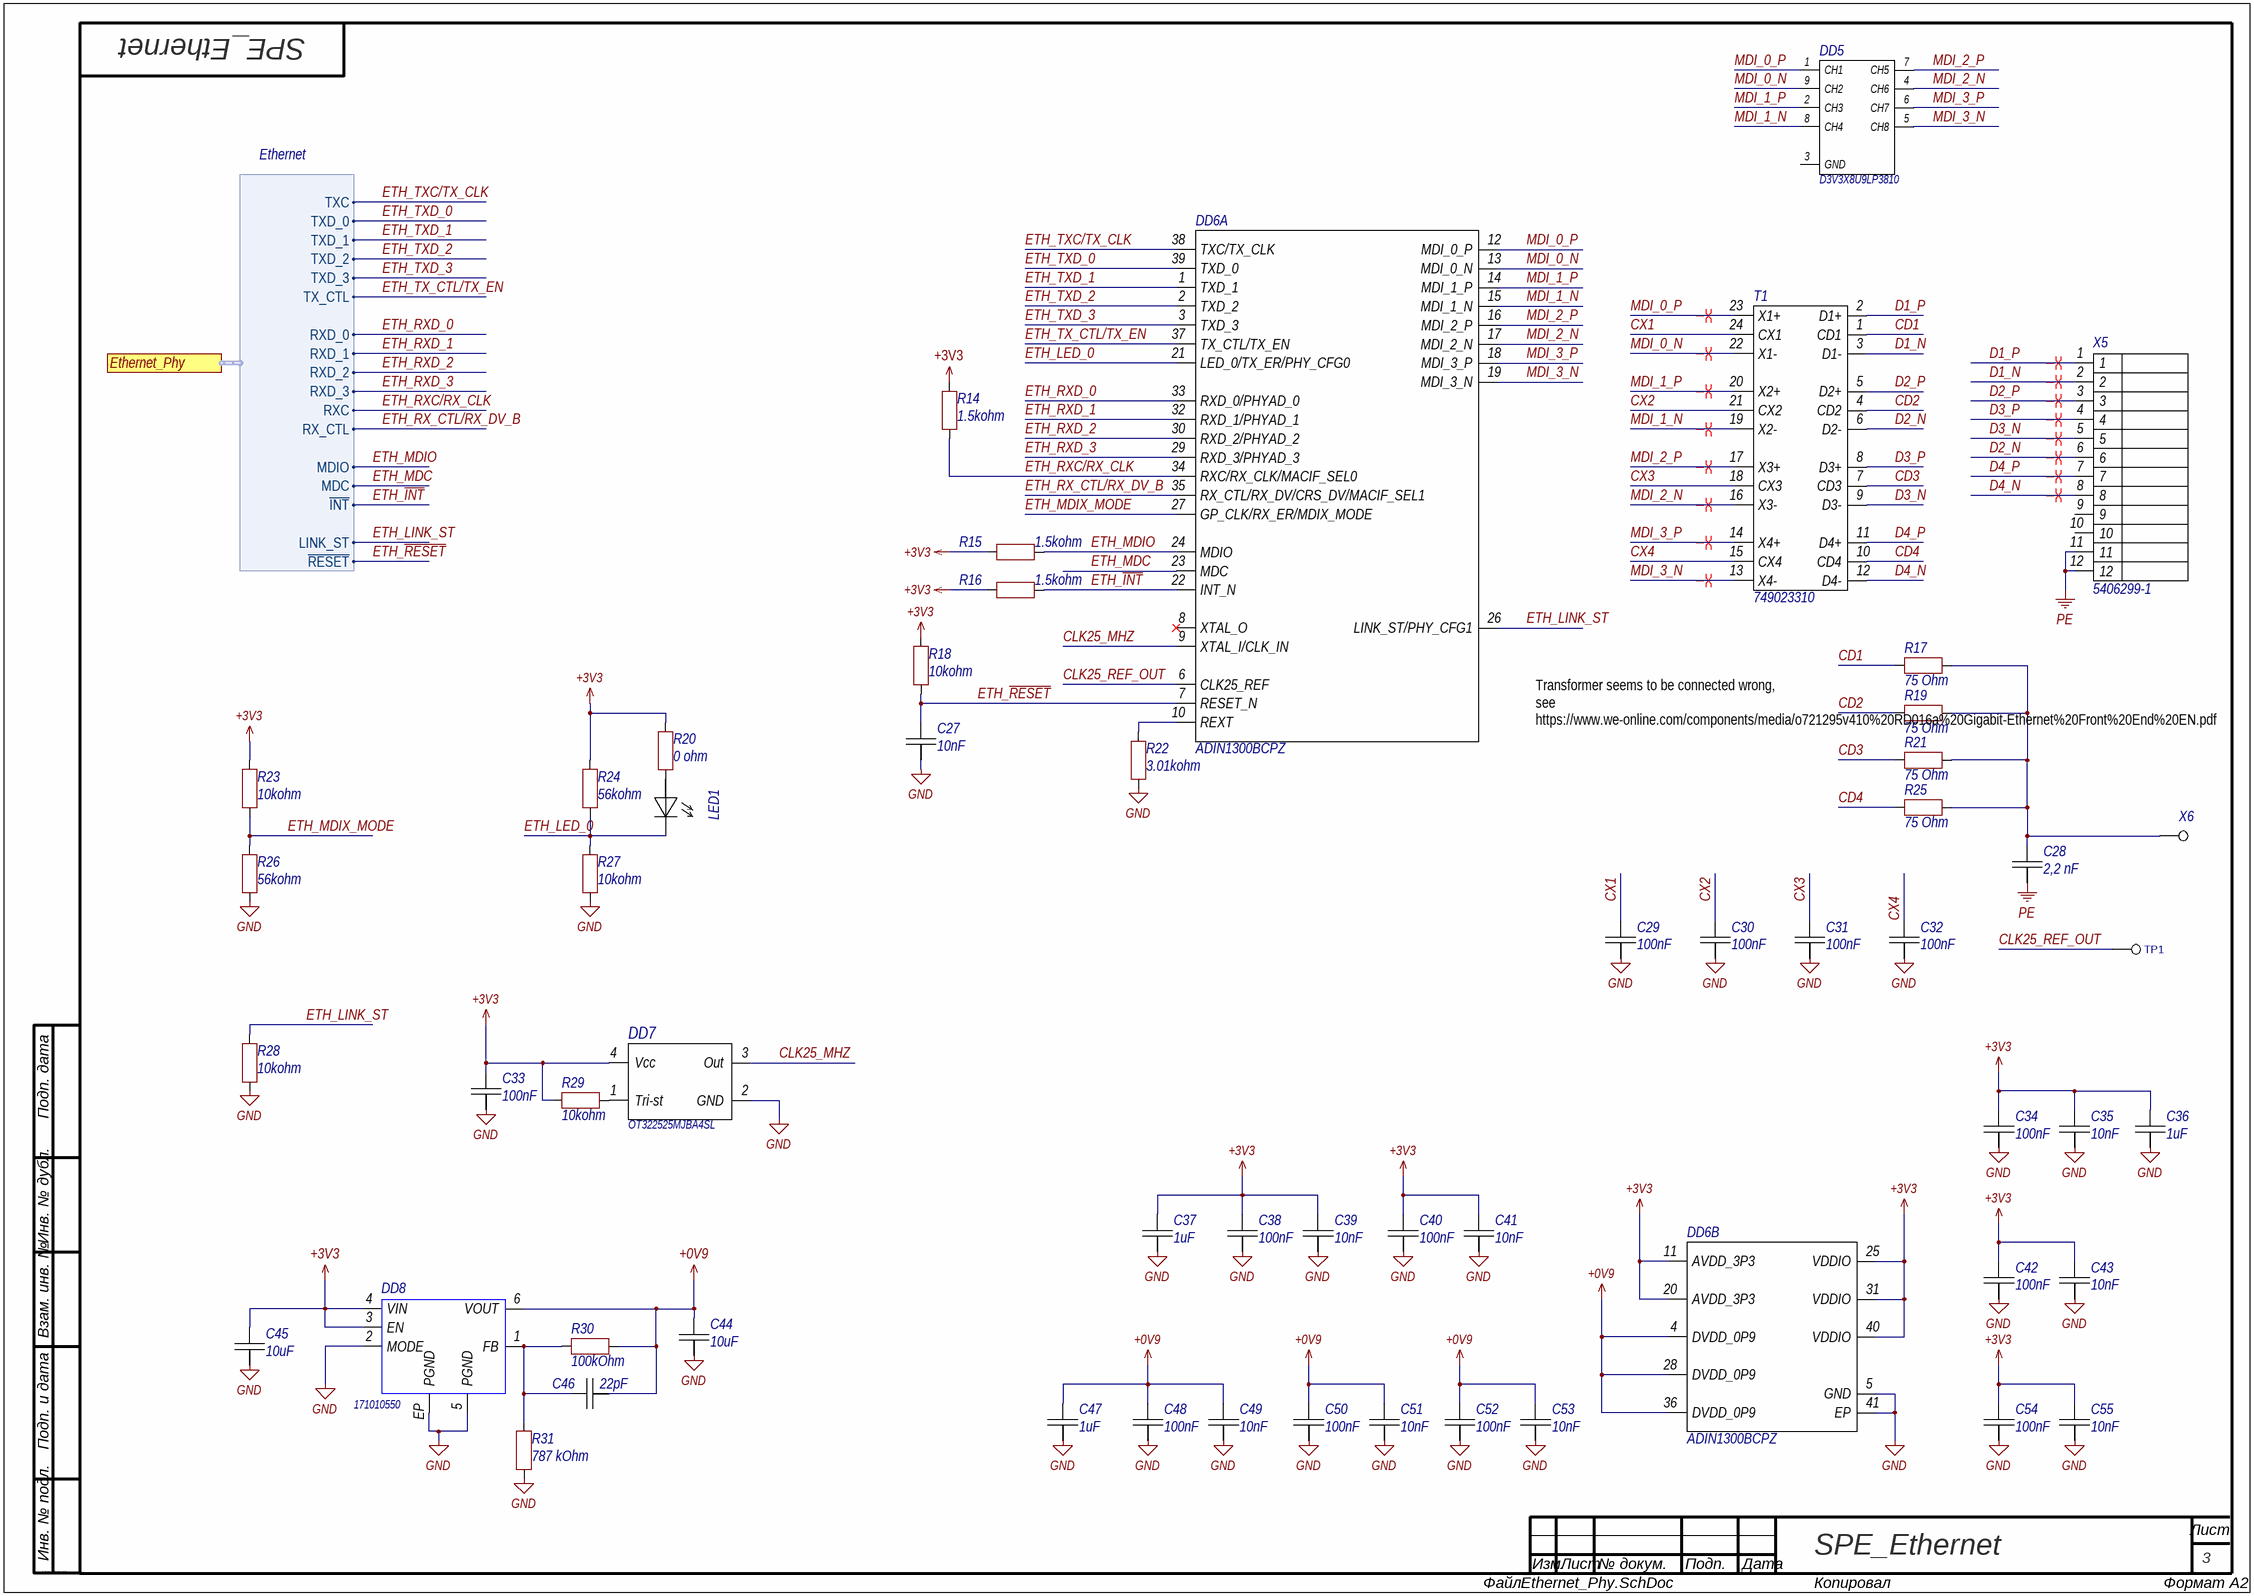
[diagram p3: Ethernet_Phy.SchDoc]

### Parts
C27  value 10nF  [CAP0402]  (hidden comment: 10nF 50V)
C28  value 2,2 nF  [CAPC1206(3216)150_L]  (hidden comment: 2,2 nF 2 kV)
C29  value 100nF  [CAP0402]  (hidden comment: 100nF 50V)
C30  value 100nF  [CAP0402]  (hidden comment: 100nF 50V)
C31  value 100nF  [CAP0402]  (hidden comment: 100nF 50V)
C32  value 100nF  [CAP0402]  (hidden comment: 100nF 50V)
C33  value 100nF  [CAP0402]  (hidden comment: 100nF 50V)
C34  value 100nF  [CAP0402]  (hidden comment: 100nF 50V)
C35  value 10nF  [CAP0402]  (hidden comment: 10nF 50V)
C36  value 1uF  [CAP0402]  (hidden comment: 1uF 25V)
C37  value 1uF  [CAP0402]  (hidden comment: 1uF 25V)
C38  value 100nF  [CAP0402]  (hidden comment: 100nF 50V)
C39  value 10nF  [CAP0402]  (hidden comment: 10nF 50V)
C40  value 100nF  [CAP0402]  (hidden comment: 100nF 50V)
C41  value 10nF  [CAP0402]  (hidden comment: 10nF 50V)
C42  value 100nF  [CAP0402]  (hidden comment: 100nF 50V)
C43  value 10nF  [CAP0402]  (hidden comment: 10nF 50V)
C44  value 10uF  [CAPC0603N]  (hidden comment: 10uF 25V)
C45  value 10uF  [CAPC0603N]  (hidden comment: 10uF 25V)
C46  value 22pF  [CAP0402]  (hidden comment: 22pF 50V)
C47  value 1uF  [CAP0402]  (hidden comment: 1uF 25V)
C48  value 100nF  [CAP0402]  (hidden comment: 100nF 50V)
C49  value 10nF  [CAP0402]  (hidden comment: 10nF 50V)
C50  value 100nF  [CAP0402]  (hidden comment: 100nF 50V)
C51  value 10nF  [CAP0402]  (hidden comment: 10nF 50V)
C52  value 100nF  [CAP0402]  (hidden comment: 100nF 50V)
C53  value 10nF  [CAP0402]  (hidden comment: 10nF 50V)
C54  value 100nF  [CAP0402]  (hidden comment: 100nF 50V)
C55  value 10nF  [CAP0402]  (hidden comment: 10nF 50V)
DD5  MPN: D3V3X8U9LP3810  [U-DFN3810-9]
DD6  MPN: ADIN1300BCPZ  [LFCSP-40]  (parts A,B of 2)
DD7  MPN: OT322525MJBA4SL  [TSX-3225_V]
DD8  (no value)  [171010550]
LED1  Green  [LED0805]  (value not drawn)
R14  1.5kohm  [RESC0402(1005)_M]
R15  1.5kohm  [RESC0402(1005)_M]
R16  1.5kohm  [RESC0402(1005)_M]
R17  75 Ohm  [RESC0603N]
R18  10kohm  [RESC0402(1005)_M]
R19  75 Ohm  [RESC0603N]
R20  0 ohm  [RESC0402(1005)_M]
R21  75 Ohm  [RESC0603N]
R22  3.01kohm  [RESC0402(1005)_M]
R23  10kohm  [RESC0402(1005)_M]
R24  56kohm  [RESC0402(1005)_M]
R25  75 Ohm  [RESC0603N]
R26  56kohm  [RESC0402(1005)_M]
R27  10kohm  [RESC0402(1005)_M]
R28  10kohm  [RESC0402(1005)_M]
R29  10kohm  [RESC0402(1005)_M]
R30  100kOhm  [RESC0402(1005)_M]
R31  787 kOhm  [RESC0805L]
T1  180 uH  [749023310]  (value not drawn)
TP1  TP-SINGLE-ROUND  [TP-ROUND-TOP-1.5]  (value not drawn)  (no BOM)
X5  5406299-1  [RJ-45_5406299-1]
X6  PLS1  [PLS1]  (value not drawn)  (no BOM)

### Ports
Ethernet_Phy (harness Ethernet)

### Harnesses
Ethernet: TXC, TXD_0, TXD_1, TXD_2, TXD_3, TX_CTL, RXD_0, RXD_1, RXD_2, RXD_3, RXC, RX_CTL, MDIO, MDC, ~{INT}, LINK_ST, ~{RESET}

### Nets
+0V9: C44.2 C46.1 C47.2 C48.2 C49.2 C50.2 C51.2 C52.2 C53.2 DD6.4(DVDD_0P9) DD6.28(DVDD_0P9) DD6.36(DVDD_0P9) DD8.6(VOUT) R30.1
+3V3: C33.2 C34.2 C35.2 C36.2 C37.2 C38.2 C39.2 C40.2 C41.2 C42.2 C43.2 C45.2 C54.2 C55.2 DD6.11(AVDD_3P3) DD6.20(AVDD_3P3) DD6.25(VDDIO) DD6.31(VDDIO) DD6.40(VDDIO) DD7.4(Vcc) DD8.3(EN) DD8.4(VIN) R14.2 R15.1 R16.1 R18.2 R20.2 R23.2 R24.2 R29.1
GND: C27.1 C29.1 C30.1 C31.1 C32.1 C33.1 C34.1 C35.1 C36.1 C37.1 C38.1 C39.1 C40.1 C41.1 C42.1 C43.1 C44.1 C45.1 C47.1 C48.1 C49.1 C50.1 C51.1 C52.1 C53.1 C54.1 C55.1 DD6.5(GND) DD6.41(EP) DD7.2(GND) DD8.2(MODE) DD8.5(PGND) DD8.EP(PGND) R22.1 R26.1 R27.1 R28.1 R31.1
PE: C28.1 X5.11 X5.12
CD1: R17.2 T1.1(CD1)  [project net CD1_3]
CD2: R19.2 T1.4(CD2)  [project net CD2_3]
CD3: R21.2 T1.7(CD3)  [project net CD3_3]
CD4: R25.2 T1.10(CD4)  [project net CD4_3]
CLK25_MHZ: DD6.9(XTAL_I/CLK_IN) DD7.3(Out)  [project net CLK25_MHZ_3]
CLK25_REF_OUT: DD6.6(CLK25_REF) TP1.1  [project net CLK25_REF_OUT_3]
CX1: C29.2 T1.24(CX1)  [project net CX1_3]
CX2: C30.2 T1.21(CX2)  [project net CX2_3]
CX3: C31.2 T1.18(CX3)  [project net CX3_3]
CX4: C32.2 T1.15(CX4)  [project net CX4_3]
D1_N: T1.3(D1-) X5.2  [project net D1_N_3]
D1_P: T1.2(D1+) X5.1  [project net D1_P_3]
D2_N: T1.6(D2-) X5.6  [project net D2_N_3]
D2_P: T1.5(D2+) X5.3  [project net D2_P_3]
D3_N: T1.9(D3-) X5.5  [project net D3_N_3]
D3_P: T1.8(D3+) X5.4  [project net D3_P_3]
D4_N: T1.12(D4-) X5.8  [project net D4_N_3]
D4_P: T1.11(D4+) X5.7  [project net D4_P_3]
ETH_~{INT}: DD6.22(INT_N) R16.2 ; port Ethernet_Phy.~{INT}
ETH_LED_0: DD6.21(LED_0/TX_ER/PHY_CFG0) LED1.1(A) R24.1 R27.2  [project net ETH_LED_0_3]
ETH_LINK_ST: DD6.26(LINK_ST/PHY_CFG1) R28.2 ; port Ethernet_Phy.LINK_ST
ETH_MDC: DD6.23(MDC) ; port Ethernet_Phy.MDC
ETH_MDIO: DD6.24(MDIO) R15.2 ; port Ethernet_Phy.MDIO
ETH_MDIX_MODE: DD6.27(GP_CLK/RX_ER/MDIX_MODE) R23.1 R26.2  [project net ETH_MDIX_MODE_3]
ETH_~{RESET}: C27.2 DD6.7(RESET_N) R18.1 ; port Ethernet_Phy.~{RESET}
ETH_RX_CTL/RX_DV_B: DD6.35(RX_CTL/RX_DV/CRS_DV/MACIF_SEL1) ; port Ethernet_Phy.RX_CTL  [project net ETH_RX_CTL]
ETH_RXC/RX_CLK: DD6.34(RXC/RX_CLK/MACIF_SEL0) R14.1 ; port Ethernet_Phy.RXC  [project net ETH_RXC]
ETH_RXD_0: DD6.33(RXD_0/PHYAD_0) ; port Ethernet_Phy.RXD_0
ETH_RXD_1: DD6.32(RXD_1/PHYAD_1) ; port Ethernet_Phy.RXD_1
ETH_RXD_2: DD6.30(RXD_2/PHYAD_2) ; port Ethernet_Phy.RXD_2
ETH_RXD_3: DD6.29(RXD_3/PHYAD_3) ; port Ethernet_Phy.RXD_3
ETH_TX_CTL/TX_EN: DD6.37(TX_CTL/TX_EN) ; port Ethernet_Phy.TX_CTL  [project net ETH_TX_CTL]
ETH_TXC/TX_CLK: DD6.38(TXC/TX_CLK) ; port Ethernet_Phy.TXC  [project net ETH_TXC]
ETH_TXD_0: DD6.39(TXD_0) ; port Ethernet_Phy.TXD_0
ETH_TXD_1: DD6.1(TXD_1) ; port Ethernet_Phy.TXD_1
ETH_TXD_2: DD6.2(TXD_2) ; port Ethernet_Phy.TXD_2
ETH_TXD_3: DD6.3(TXD_3) ; port Ethernet_Phy.TXD_3
MDI_0_N: DD5.9(CH2) DD6.13(MDI_0_N) T1.22(X1-)  [project net MDI_0_N_3]
MDI_0_P: DD5.1(CH1) DD6.12(MDI_0_P) T1.23(X1+)  [project net MDI_0_P_3]
MDI_1_N: DD5.8(CH4) DD6.15(MDI_1_N) T1.19(X2-)  [project net MDI_1_N_3]
MDI_1_P: DD5.2(CH3) DD6.14(MDI_1_P) T1.20(X2+)  [project net MDI_1_P_3]
MDI_2_N: DD5.4(CH6) DD6.17(MDI_2_N) T1.16(X3-)  [project net MDI_2_N_3]
MDI_2_P: DD5.7(CH5) DD6.16(MDI_2_P) T1.17(X3+)  [project net MDI_2_P_3]
MDI_3_N: DD5.5(CH8) DD6.19(MDI_3_N) T1.13(X4-)  [project net MDI_3_N_3]
MDI_3_P: DD5.6(CH7) DD6.18(MDI_3_P) T1.14(X4+)  [project net MDI_3_P_3]
NetC28_2: C28.2 R17.1 R19.1 R21.1 R25.1 X6.1
NetC46_2: C46.2 DD8.1(FB) R30.2 R31.2
NetDD6_10: DD6.10(REXT) R22.2
NetDD7_1: DD7.1(Tri-st) R29.2
NetLED1_2: LED1.2(K) R20.1

Not connected (* = marked no-connect by the designer): DD5 3(GND); DD6 8(XTAL_O)*; X5 9 10

### Layout directives
differential pair; differential pair class Diff_100; net class Diff_pair: D1_N_3, D1_P_3, D2_N_3, D2_P_3, D3_N_3, D3_P_3, D4_N_3, D4_P_3, MDI_0_N_3, MDI_0_P_3, MDI_1_N_3, MDI_1_P_3, MDI_2_N_3, MDI_2_P_3, MDI_3_N_3, MDI_3_P_3

### Notes on the sheet
- Transformer seems to be connected wrong, see
  https://www.we-online.com/components/media/o721295v410%20RD016a%20Gigabit-Ethernet%20Front%20End%20EN.pdf
- Подп. дата
- Инв. № дубл.
- Взам. инв. №
- Подп. и дата
- Инв. № подл.
- Изм.
- Лист
- № докум.
- Подп.
- Дата
- ALTIUM GOSTBOM2.0 KEV
- Файл:
- Копировал
- Формат А2

### Library data of the parts
C27 C29-C43 C46-C55 = CAP0402: MntType: SMD; MSL: MSL 1; Package: =Footprint; RoHS: Comply; PartType: CHIP CERAMIC CAPACITOR; Pins: 2; BOMDescription: =MntType+' '+PartType+' '+Package+' '+Value+' '+Tolerance+' '+Voltage+' '+TempCoeff+' '+MPN; CFootprint: =Footprint; Part Number: CAP0402; ClassName: Capacitor; ComponentLink1Description: Datasheet
  C27 C29-C35 C38-C43 C46 C48-C55: Voltage: 50V
  C36 C37 C47: Voltage: 25V
C28 = CAPC: MntType: SMD; Voltage: 2 kV; MSL: MSL 1; Package: =Footprint; RoHS: Comply; PartType: CHIP CERAMIC CAPACITOR; Pins: 2; BOMDescription: =MntType+' '+PartType+' '+Package+' '+Value+' '+Tolerance+' '+Voltage+' '+TempCoeff+' '+MPN; CFootprint: =Footprint; Part Number: CAPC; ClassName: Capacitor; ComponentLink1Description: Datasheet
C44 C45 = CAPC: MntType: SMD; MSL: MSL 1; Package: =Footprint; RoHS: Comply; PartType: CHIP CERAMIC CAPACITOR; Pins: 2; BOMDescription: =MntType+' '+PartType+' '+Package+' '+Value+' '+Tolerance+' '+Voltage+' '+TempCoeff+' '+MPN; CFootprint: =Footprint; Voltage: 25V; Part Number: CAPC; ClassName: Capacitor; ComponentLink1Description: Datasheet
DD5 = D3V3X8U9LP3810: Manufacturer: DiodesInc; MntType: SMD; Part Number: D3V3X8U9LP3810; MSL: MSL 1; Package: =Footprint; RoHS: Comply; PartType: TVS; Pins: 9; BOMDescription: D3V3X8U9LP3810; CFootprint: =Footprint; ClassName: TVS; ComponentLink1Description: Datasheet; ComponentLink1URL: https://www.diodes.com/assets/Datasheets/D3V3X8U9LP3810.pdf
DD6 = ADIN1300BCPZ: Manufacturer: AD; PartTypeRUS: пїЅпїЅпїЅпїЅпїЅпїЅпїЅпїЅпїЅпїЅ; MntType: SMD; ID: 46; BOMDescriptionRUS: пїЅпїЅпїЅпїЅпїЅпїЅпїЅпїЅпїЅпїЅ ADIN1300BCPZ; Part Number: ADIN1300BCPZ; MSL: MSL 1; Package: =Footprint; RoHS: Comply; PartType: Ethernet Phy; Pins: 41; BOMDescription: ADIN1300BCPZ; CFootprint: =Footprint; ClassName: Ethernet Phy; ComponentLink1Description: Datasheet; ComponentLink1URL: https://www.analog.com/media/en/technical-documentation/data-sheets/ADIN1300.pdf
DD7 = OT322525MJBA4SL: Manufacturer: Yangxing Tech; Value: 25MHz; MntType: SMD; Part Number: OT322525MJBA4SL; MSL: MSL 1; Package: SMD3225; RoHS: Comply; PartType: Oscillator; Pins: 4; BOMDescription: OT322525MJBA4SL; CFootprint: =Footprint; ClassName: Oscillator; ComponentLink1Description: Datasheet; ComponentLink1URL: https://datasheet.lcsc.com/lcsc/2103291238_Yangxing-Tech-OT322525MJBA4SL_C669088.pdf
DD8 = 171010550: Manufacturer: WE; MntType: SMD; MPN: 171010550; Part Number: 171010550; MSL: MSL 1; Package: LGA-6EP; RoHS: Comply; PartType: Buck converter; Pins: 8; BOMDescription: 171010550; CFootprint: =Footprint; ClassName: Buck; ComponentLink1Description: Datasheet; ComponentLink1URL: https://www.we-online.com/catalog/datasheet/171010550_valid_from_2021-12-01.pdf
LED1 = LEDC0805: as LED2 on sheet SPE_Phy; MSL: MSL 5; Package: =Footprint; RoHS: Comply; PartType: CHIP LED; Pins: 2; BOMDescription: =MntType+' '+PartType+' '+Package+' '+Value+' '+Tolerance+' '+Voltage+' '+TempCoeff+' '+MPN; CFootprint: =Footprint; Value: Green; Part Number: LEDC0805; BOMDescriptionRUS: пїЅпїЅпїЅпїЅпїЅпїЅпїЅпїЅпїЅ; ClassName: LED; ComponentLink1Description: Datasheet
R14-R16 R18 R20 R23 R24 R26-R30 = RES0402: MntType: SMD; MSL: MSL 1; Package: =Footprint; RoHS: Comply; PartType: CHIP RESISTOR; Pins: 2; BOMDescription: =MntType+' '+PartType+' '+Package+' '+Value+' '+Tolerance+' '+Voltage+' '+TempCoeff+' '+MPN; CFootprint: =Footprint; Part Number: RES0402; ClassName: Resistor; ComponentLink1Description: Datasheet
  R14-R16: Value: 1.5kohm
  R18 R23 R27-R29: Value: 10kohm
  R20: Value: 0 ohm
  R24 R26: Value: 56kohm
  R30: Value: 100kOhm
R17 R19 R21 R25 = RES: MntType: SMD; MSL: MSL 1; Package: =Footprint; RoHS: Comply; PartType: CHIP RESISTOR; Pins: 2; BOMDescription: =MntType+' '+PartType+' '+Package+' '+Value+' '+Tolerance+' '+Voltage+' '+TempCoeff+' '+MPN; CFootprint: =Footprint; Value: 75 Ohm; Part Number: RES; ClassName: Resistor; ComponentLink1Description: Datasheet
R22 = RES0402: MntType: SMD; Tolerance: 1%; MSL: MSL 1; Package: =Footprint; RoHS: Comply; PartType: CHIP RESISTOR; Pins: 2; BOMDescription: =MntType+' '+PartType+' '+Package+' '+Value+' '+Tolerance+' '+Voltage+' '+TempCoeff+' '+MPN; CFootprint: =Footprint; Value: 3.01kohm; Part Number: RES0402; ClassName: Resistor; ComponentLink1Description: Datasheet
R31 = RES: as R43 on sheet SPE_Phy; MSL: MSL 1; Package: =Footprint; RoHS: Comply; PartType: CHIP RESISTOR; Pins: 2; BOMDescription: =MntType+' '+PartType+' '+Package+' '+Value+' '+Tolerance+' '+Voltage+' '+TempCoeff+' '+MPN; CFootprint: =Footprint; Value: 787 kOhm; Part Number: RES; ClassName: Resistor; ComponentLink1Description: Datasheet; BOMDescriptionRUS: пїЅпїЅпїЅпїЅпїЅпїЅпїЅпїЅ
T1 = 749023310: WE-LAN AQ SMT Transformer, 1000 Base-T, PoE (up to 350 mA), 180uH; Manufacturer: WE; MntType: SMD; MPN: 749023310; Part Number: 749023310; MSL: MSL 1; RoHS: Comply; PartType: Transformer; BOMDescription: 749023310; CFootprint: =Footprint; ClassName: Transformer; ComponentLink1Description: Datasheet; ComponentLink1URL: https://www.we-online.com/catalog/datasheet/749023310.pdf
TP1 = TP-SINGLE-ROUND: MntType: SMD; MSL: MSL 1; RoHS: Comply; BOMDescription: SMD; CFootprint: =Footprint; Part Number: TP-SINGLE-ROUND; ClassName: Touch; ComponentLink1Description: Datasheet
X5 = 5406299-1: Manufacturer: TE; MntType: DIP; System: Connector; MPN: 5406299-1; Part Number: 5406299-1; MSL: MSL 1; Package: RJ45; RoHS: Comply; PartType: CONNECTOR; Pins: 12; BOMDescription: 5406299-1; CFootprint: =Footprint; ClassName: Connector; ComponentLink1Description: Datasheet; ComponentLink1URL: https://www.te.com/commerce/DocumentDelivery/DDEController?Action=srchrtrv&DocNm=5406299&DocType=Customer+Drawing&DocLang=English&PartCntxt=5406299-1&DocFormat=pdf
X6 = Test_PLS1: MntType: DIP; BOMDescription: DIP PLS; System: Connector; MSL: MSL 1; RoHS: Comply; PartType: PLS; Pins: 1; CFootprint: =Footprint; Part Number: Test_PLS1; ClassName: Test_Point; ComponentLink1Description: Datasheet

## Nets that join several sheets
+3V3: FPGA (48 pins), SPE_Phy (23 pins), Ethernet_Phy (30 pins)
GND: FPGA (54 pins), SPE_Phy (27 pins), Ethernet_Phy (38 pins)
ETH_~{INT}: FPGA (DD1.41), Ethernet_Phy (DD6.22 R16.2)
ETH_LINK_ST: FPGA (DD1.38), Ethernet_Phy (DD6.26 R28.2)
ETH_MDC: FPGA (DD1.40), Ethernet_Phy (DD6.23)
ETH_MDIO: FPGA (DD1.39), Ethernet_Phy (DD6.24 R15.2)
ETH_~{RESET}: FPGA (DD1.29), Ethernet_Phy (C27.2 DD6.7 R18.1)
ETH_RX_CTL: FPGA (DD1.48), Ethernet_Phy (DD6.35)
ETH_RXC: FPGA (DD1.49), Ethernet_Phy (DD6.34 R14.1)
ETH_RXD_0: FPGA (DD1.50), Ethernet_Phy (DD6.33)
ETH_RXD_1: FPGA (DD1.51), Ethernet_Phy (DD6.32)
ETH_RXD_2: FPGA (DD1.52), Ethernet_Phy (DD6.30)
ETH_RXD_3: FPGA (DD1.54), Ethernet_Phy (DD6.29)
ETH_TX_CTL: FPGA (DD1.28), Ethernet_Phy (DD6.37)
ETH_TXC: FPGA (DD1.27), Ethernet_Phy (DD6.38)
ETH_TXD_0: FPGA (DD1.26), Ethernet_Phy (DD6.39)
ETH_TXD_1: FPGA (DD1.25), Ethernet_Phy (DD6.1)
ETH_TXD_2: FPGA (DD1.24), Ethernet_Phy (DD6.2)
ETH_TXD_3: FPGA (DD1.23), Ethernet_Phy (DD6.3)
SPE_CTL: FPGA (DD1.115), SPE_Phy (DD9.37)
SPE_~{INT}: FPGA (DD1.136), SPE_Phy (DD9.25 R42.2)
SPE_LINK_ST: FPGA (DD1.124), SPE_Phy (DD9.4 R43.1)
SPE_MDC: FPGA (DD1.134), SPE_Phy (DD9.27)
SPE_MDIO: FPGA (DD1.135), SPE_Phy (DD9.26 R44.2)
SPE_~{RESET}: FPGA (DD1.125), SPE_Phy (DD9.5)
SPE_RX_CTL: FPGA (DD1.128), SPE_Phy (DD9.33)
SPE_RX_ER: FPGA (DD1.126), SPE_Phy (DD9.34 R41.1)
SPE_RXC: FPGA (DD1.129), SPE_Phy (DD9.32 R36.1)
SPE_RXD_0: FPGA (DD1.130), SPE_Phy (DD9.31)
SPE_RXD_1: FPGA (DD1.131), SPE_Phy (DD9.30)
SPE_RXD_2: FPGA (DD1.132), SPE_Phy (DD9.29)
SPE_RXD_3: FPGA (DD1.133), SPE_Phy (DD9.28)
SPE_TX_ER: FPGA (DD1.116), SPE_Phy (DD9.36)
SPE_TXC: FPGA (DD1.114), SPE_Phy (DD9.38)
SPE_TXD_0: FPGA (DD1.113), SPE_Phy (DD9.39)
SPE_TXD_1: FPGA (DD1.112), SPE_Phy (DD9.40)
SPE_TXD_2: FPGA (DD1.111), SPE_Phy (DD9.1)
SPE_TXD_3: FPGA (DD1.110), SPE_Phy (DD9.2)